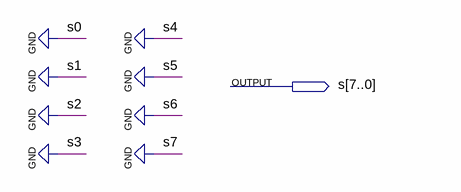
[diagram p0: schematic sheet]
// Quartus schematic gnd_8bits.bdf as structural Verilog: 0 symbols, 1 pins
module gnd_8bits (
  output [7:0] s
);


  assign s = {8{1'b0}};
endmodule
